# EAGLE schematic eib-128-256-nanoz-adapter (EAGLE 8.3.2)
DESIGNER: JPN@MIT; DESIGN_NAME: Headstage 128/256 NanoZ Adapter; LICENSE: CERN OHL v1.2; REVISION: 1.0
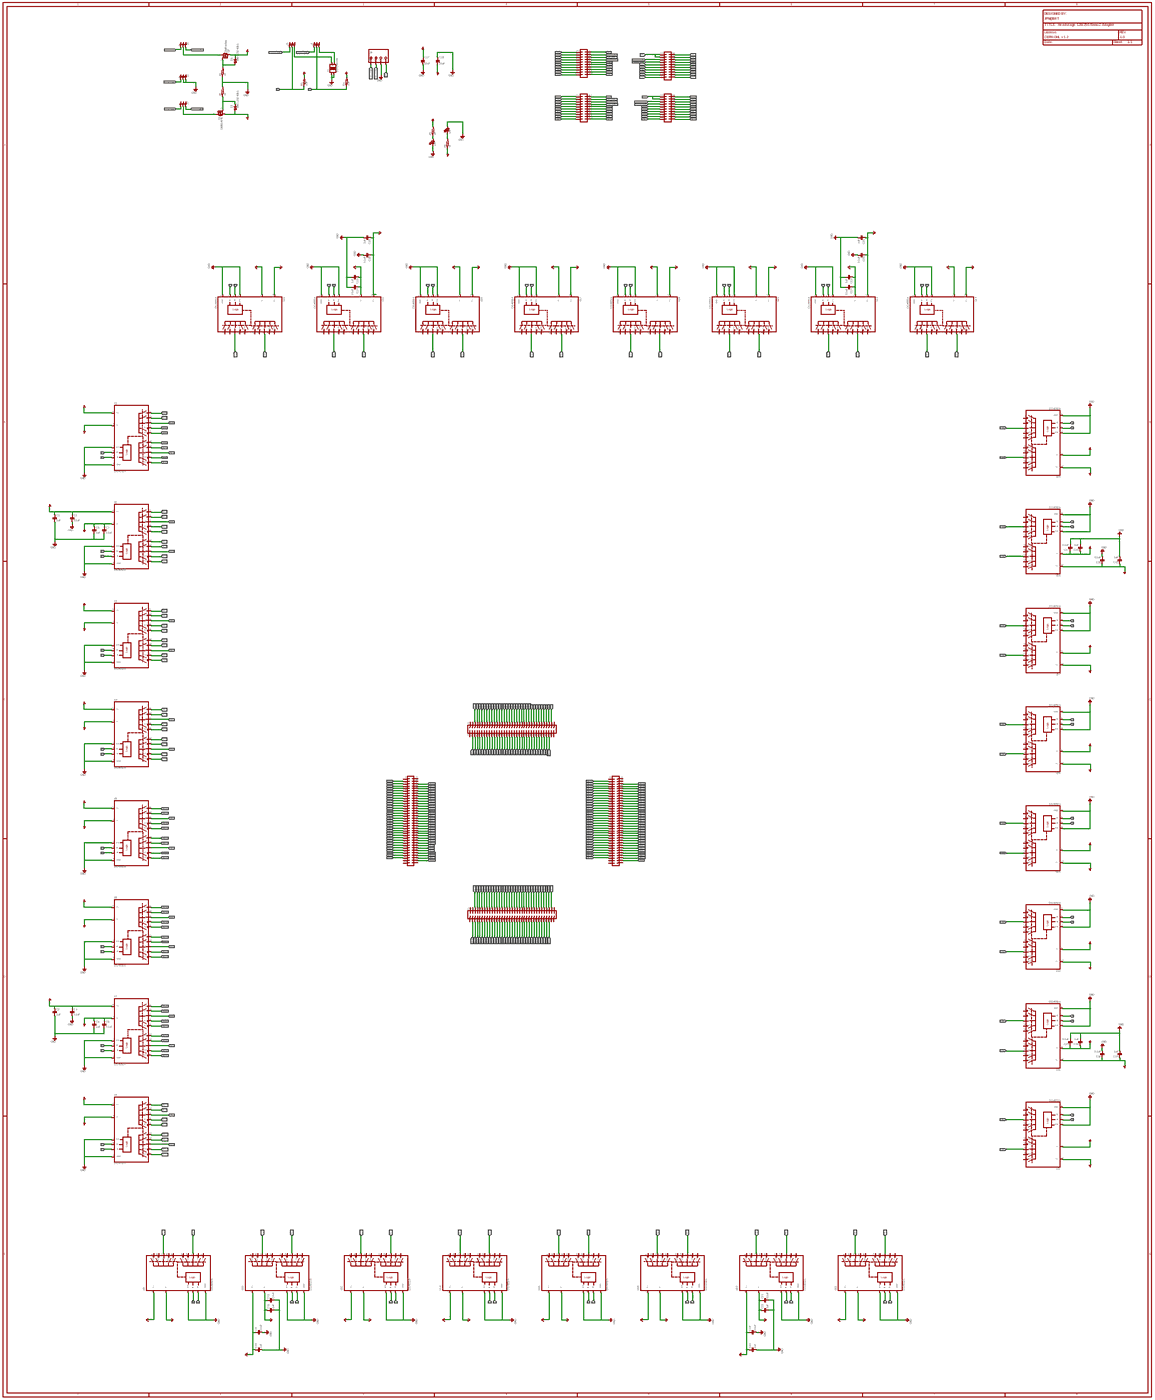
[diagram p0: schematic, sheet 1, overview]
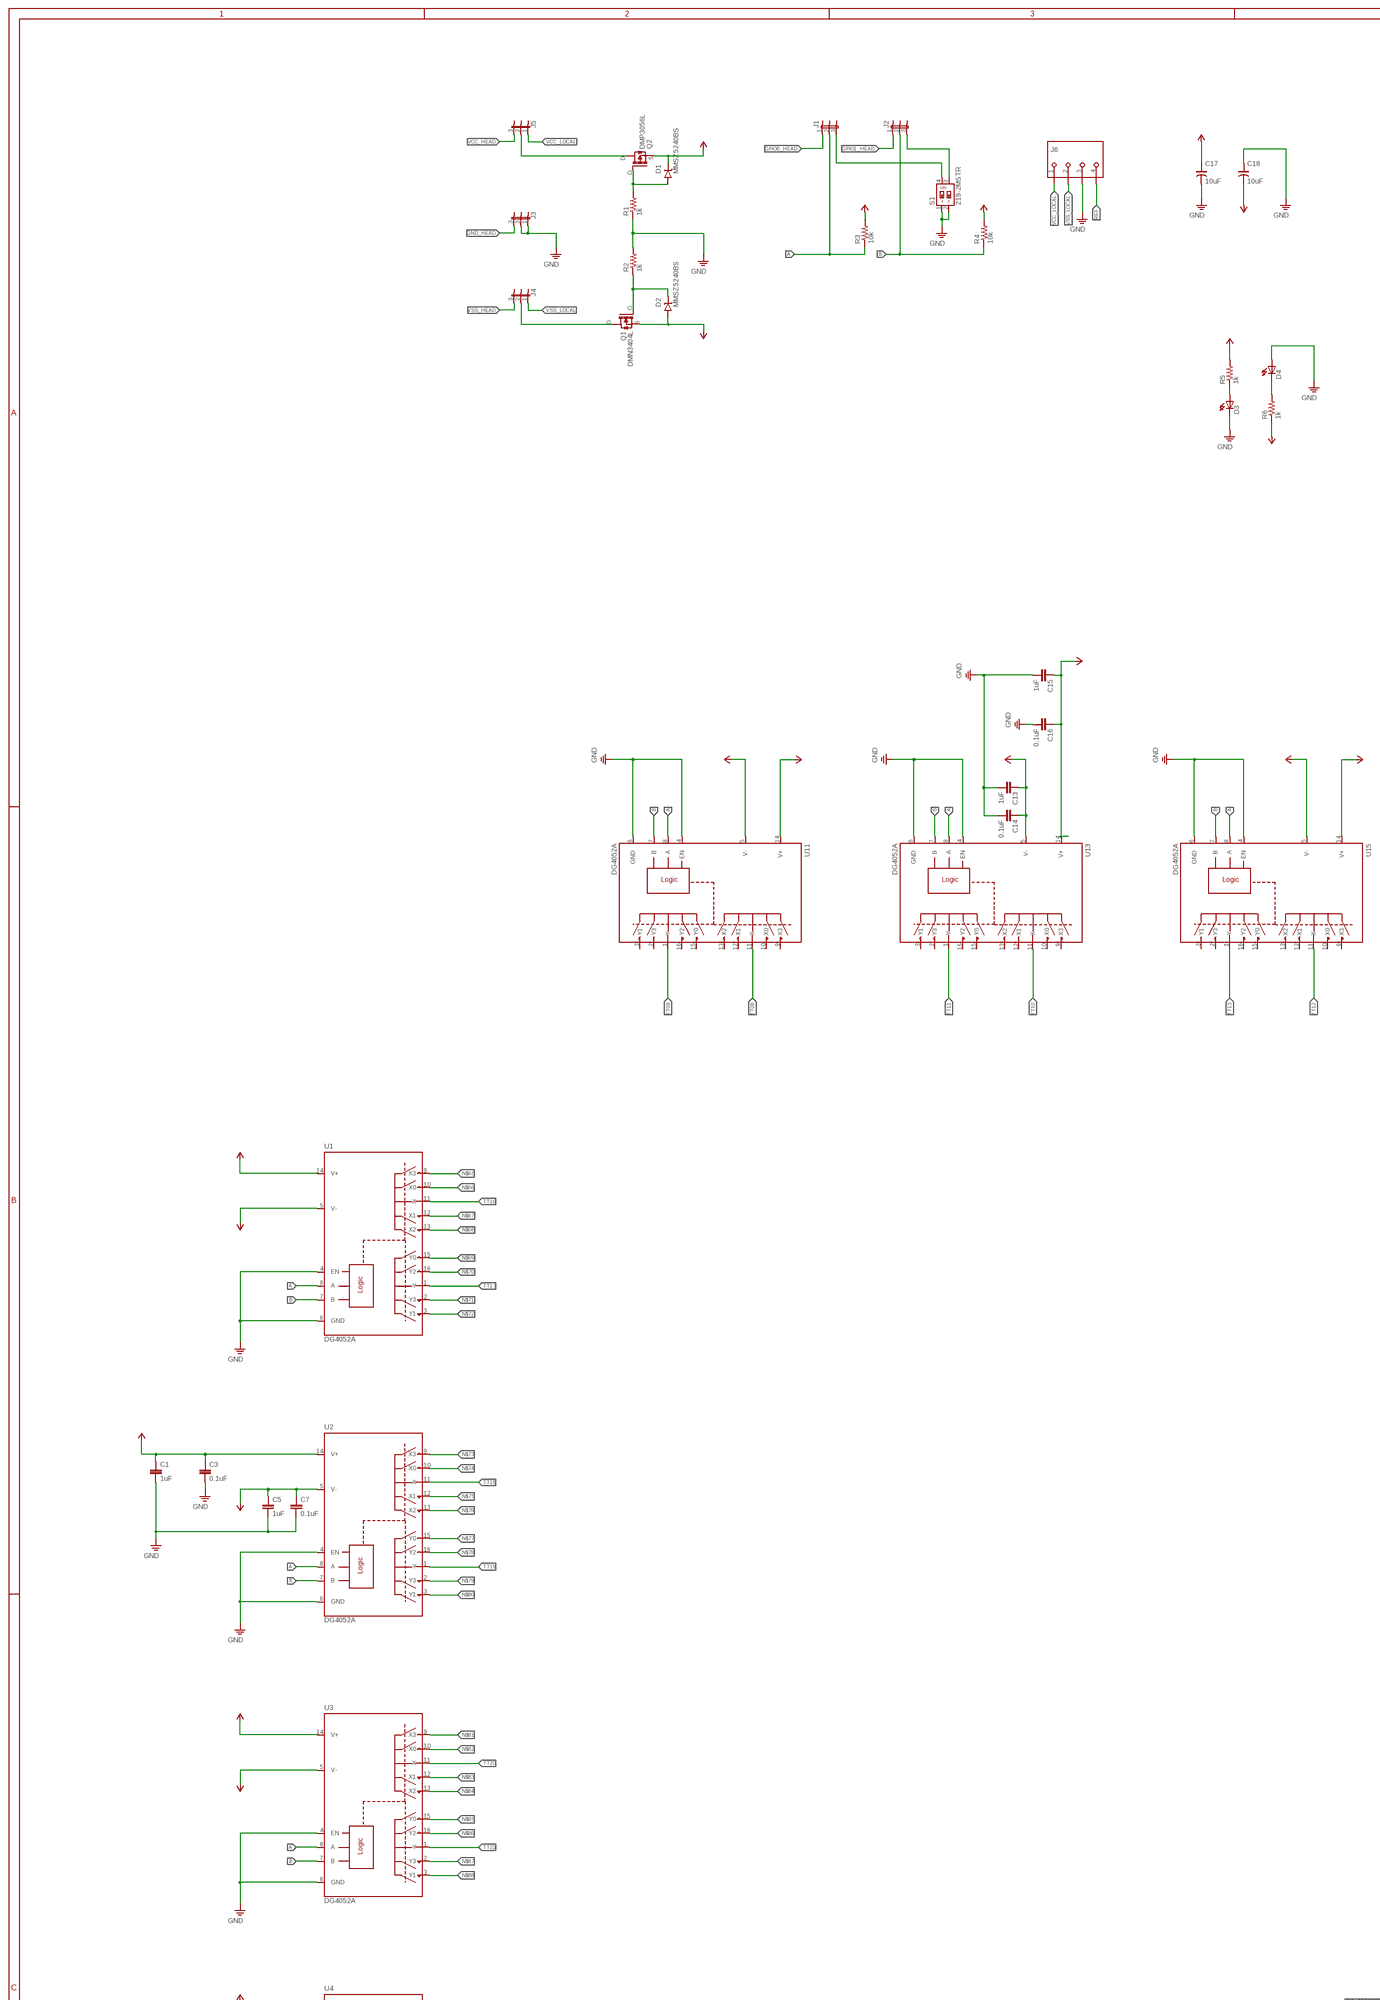
[diagram p1: schematic, sheet 1, part 1 of 4]
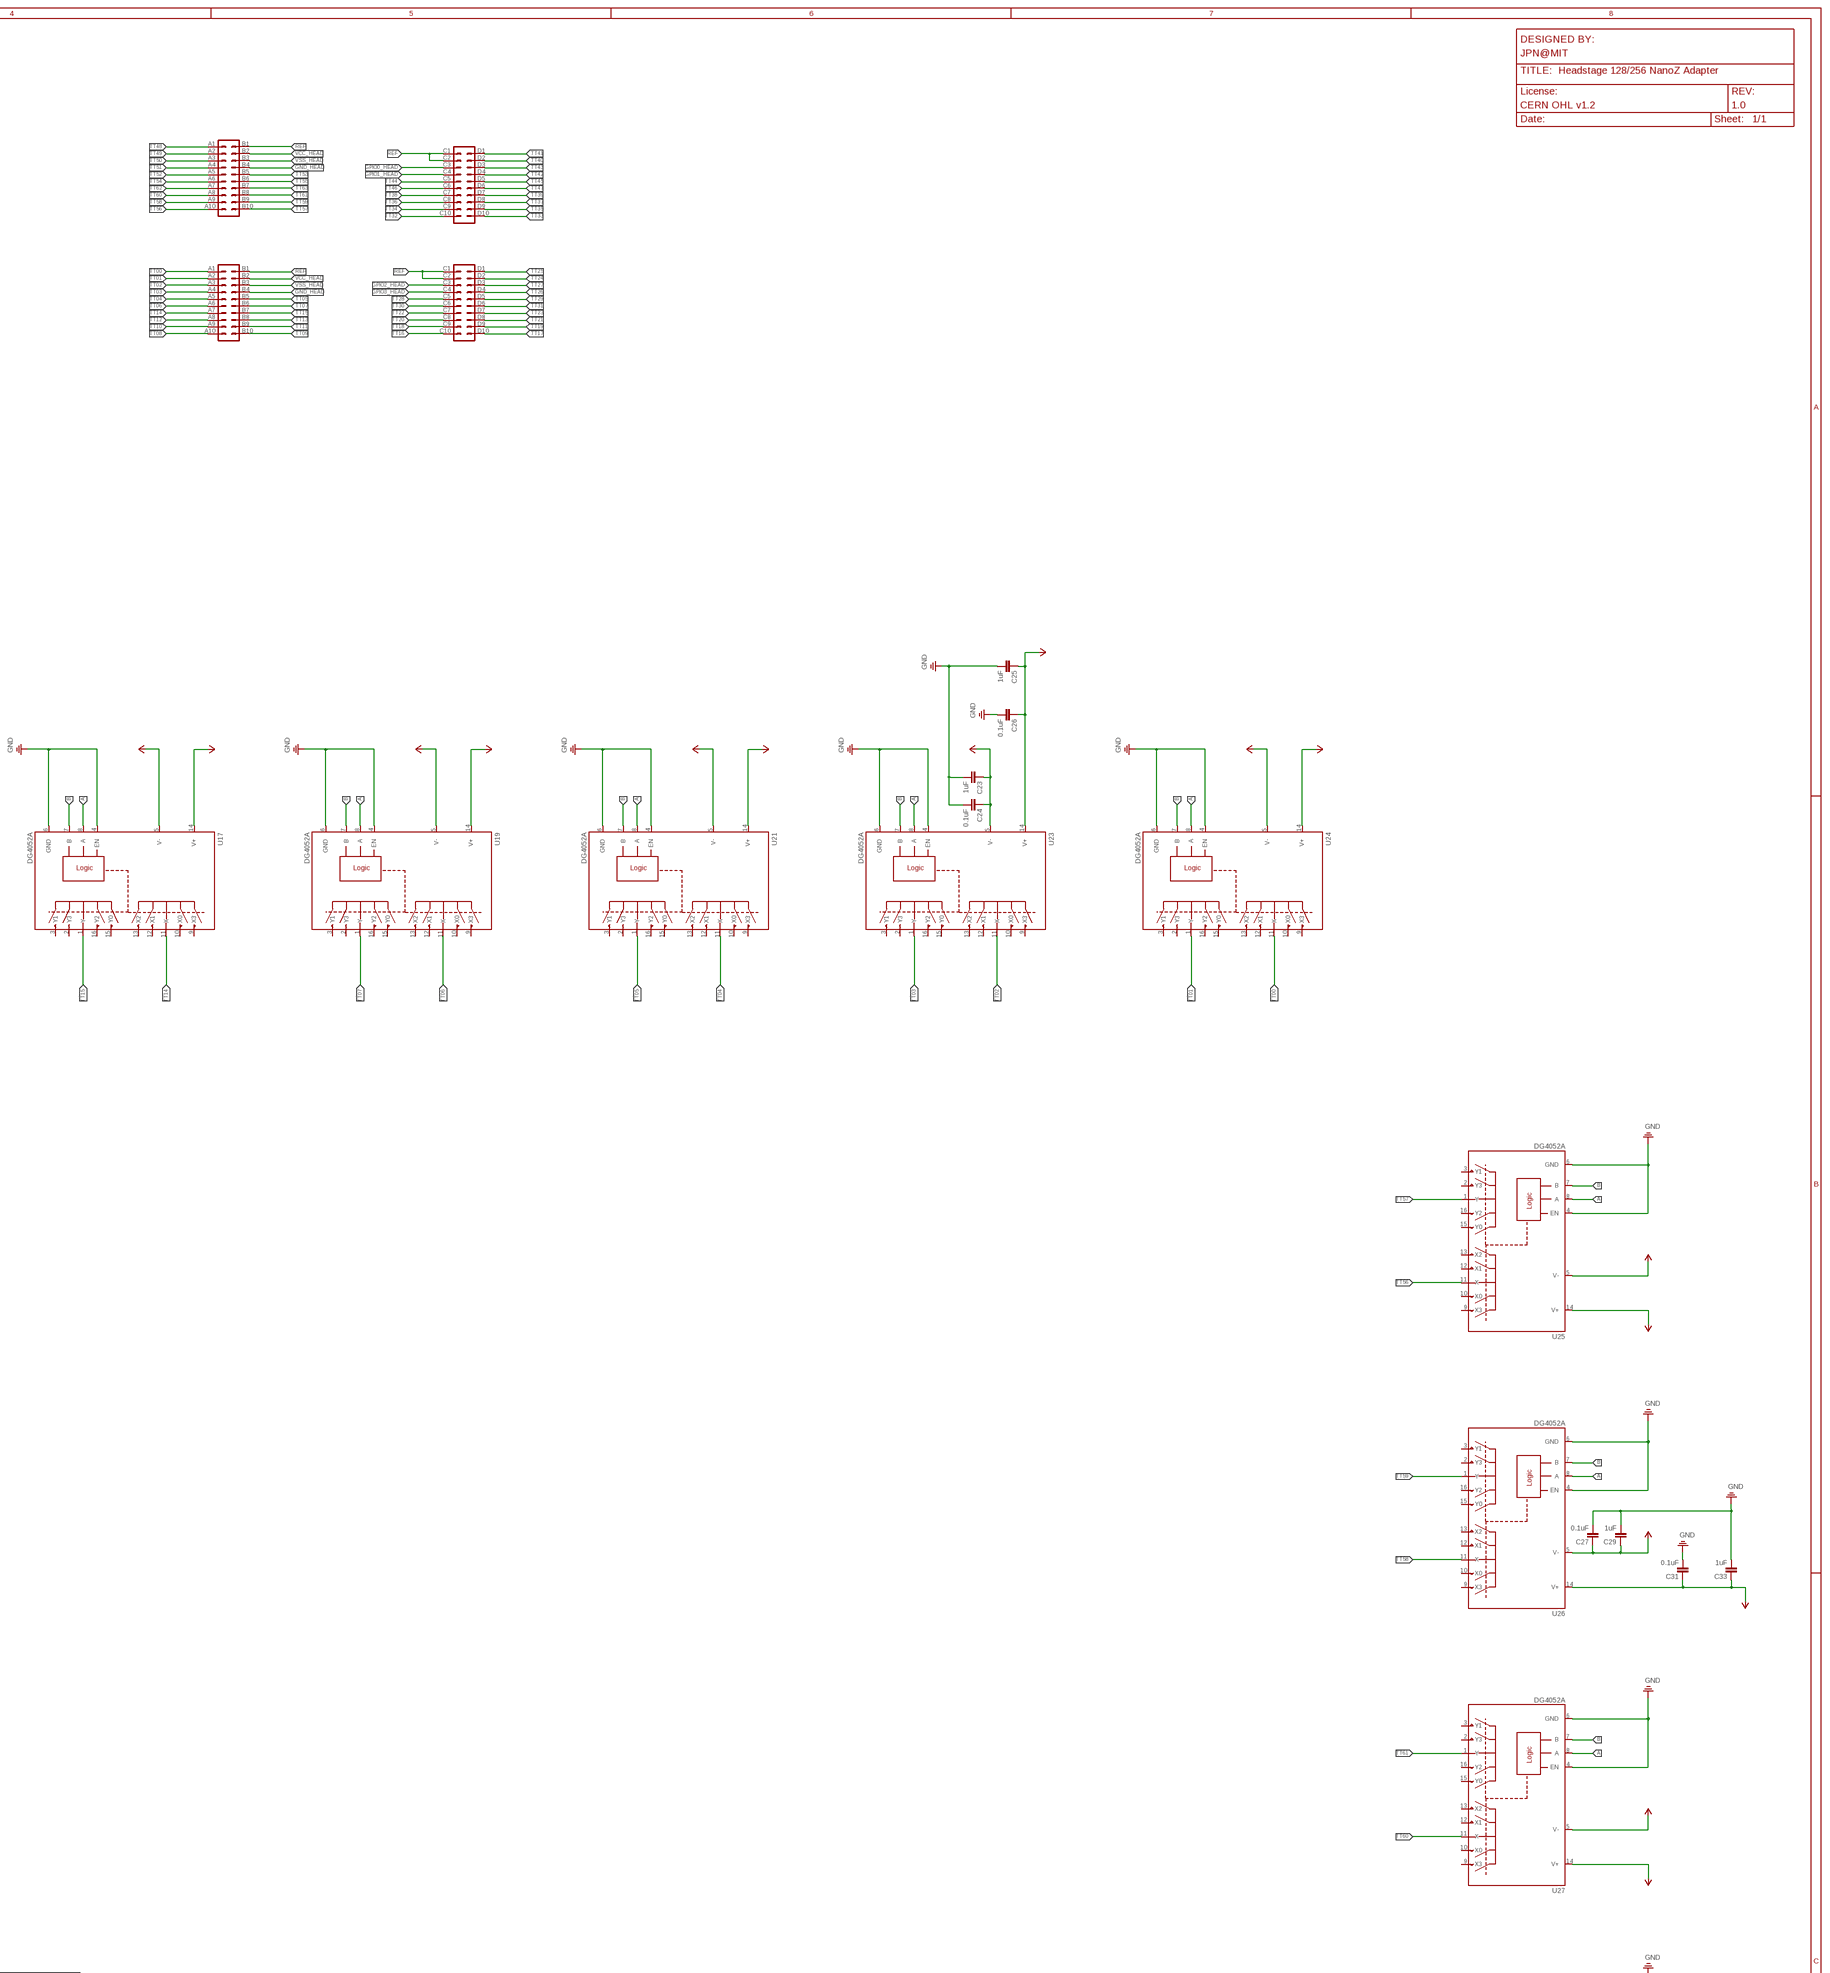
[diagram p2: schematic, sheet 1, part 2 of 4]
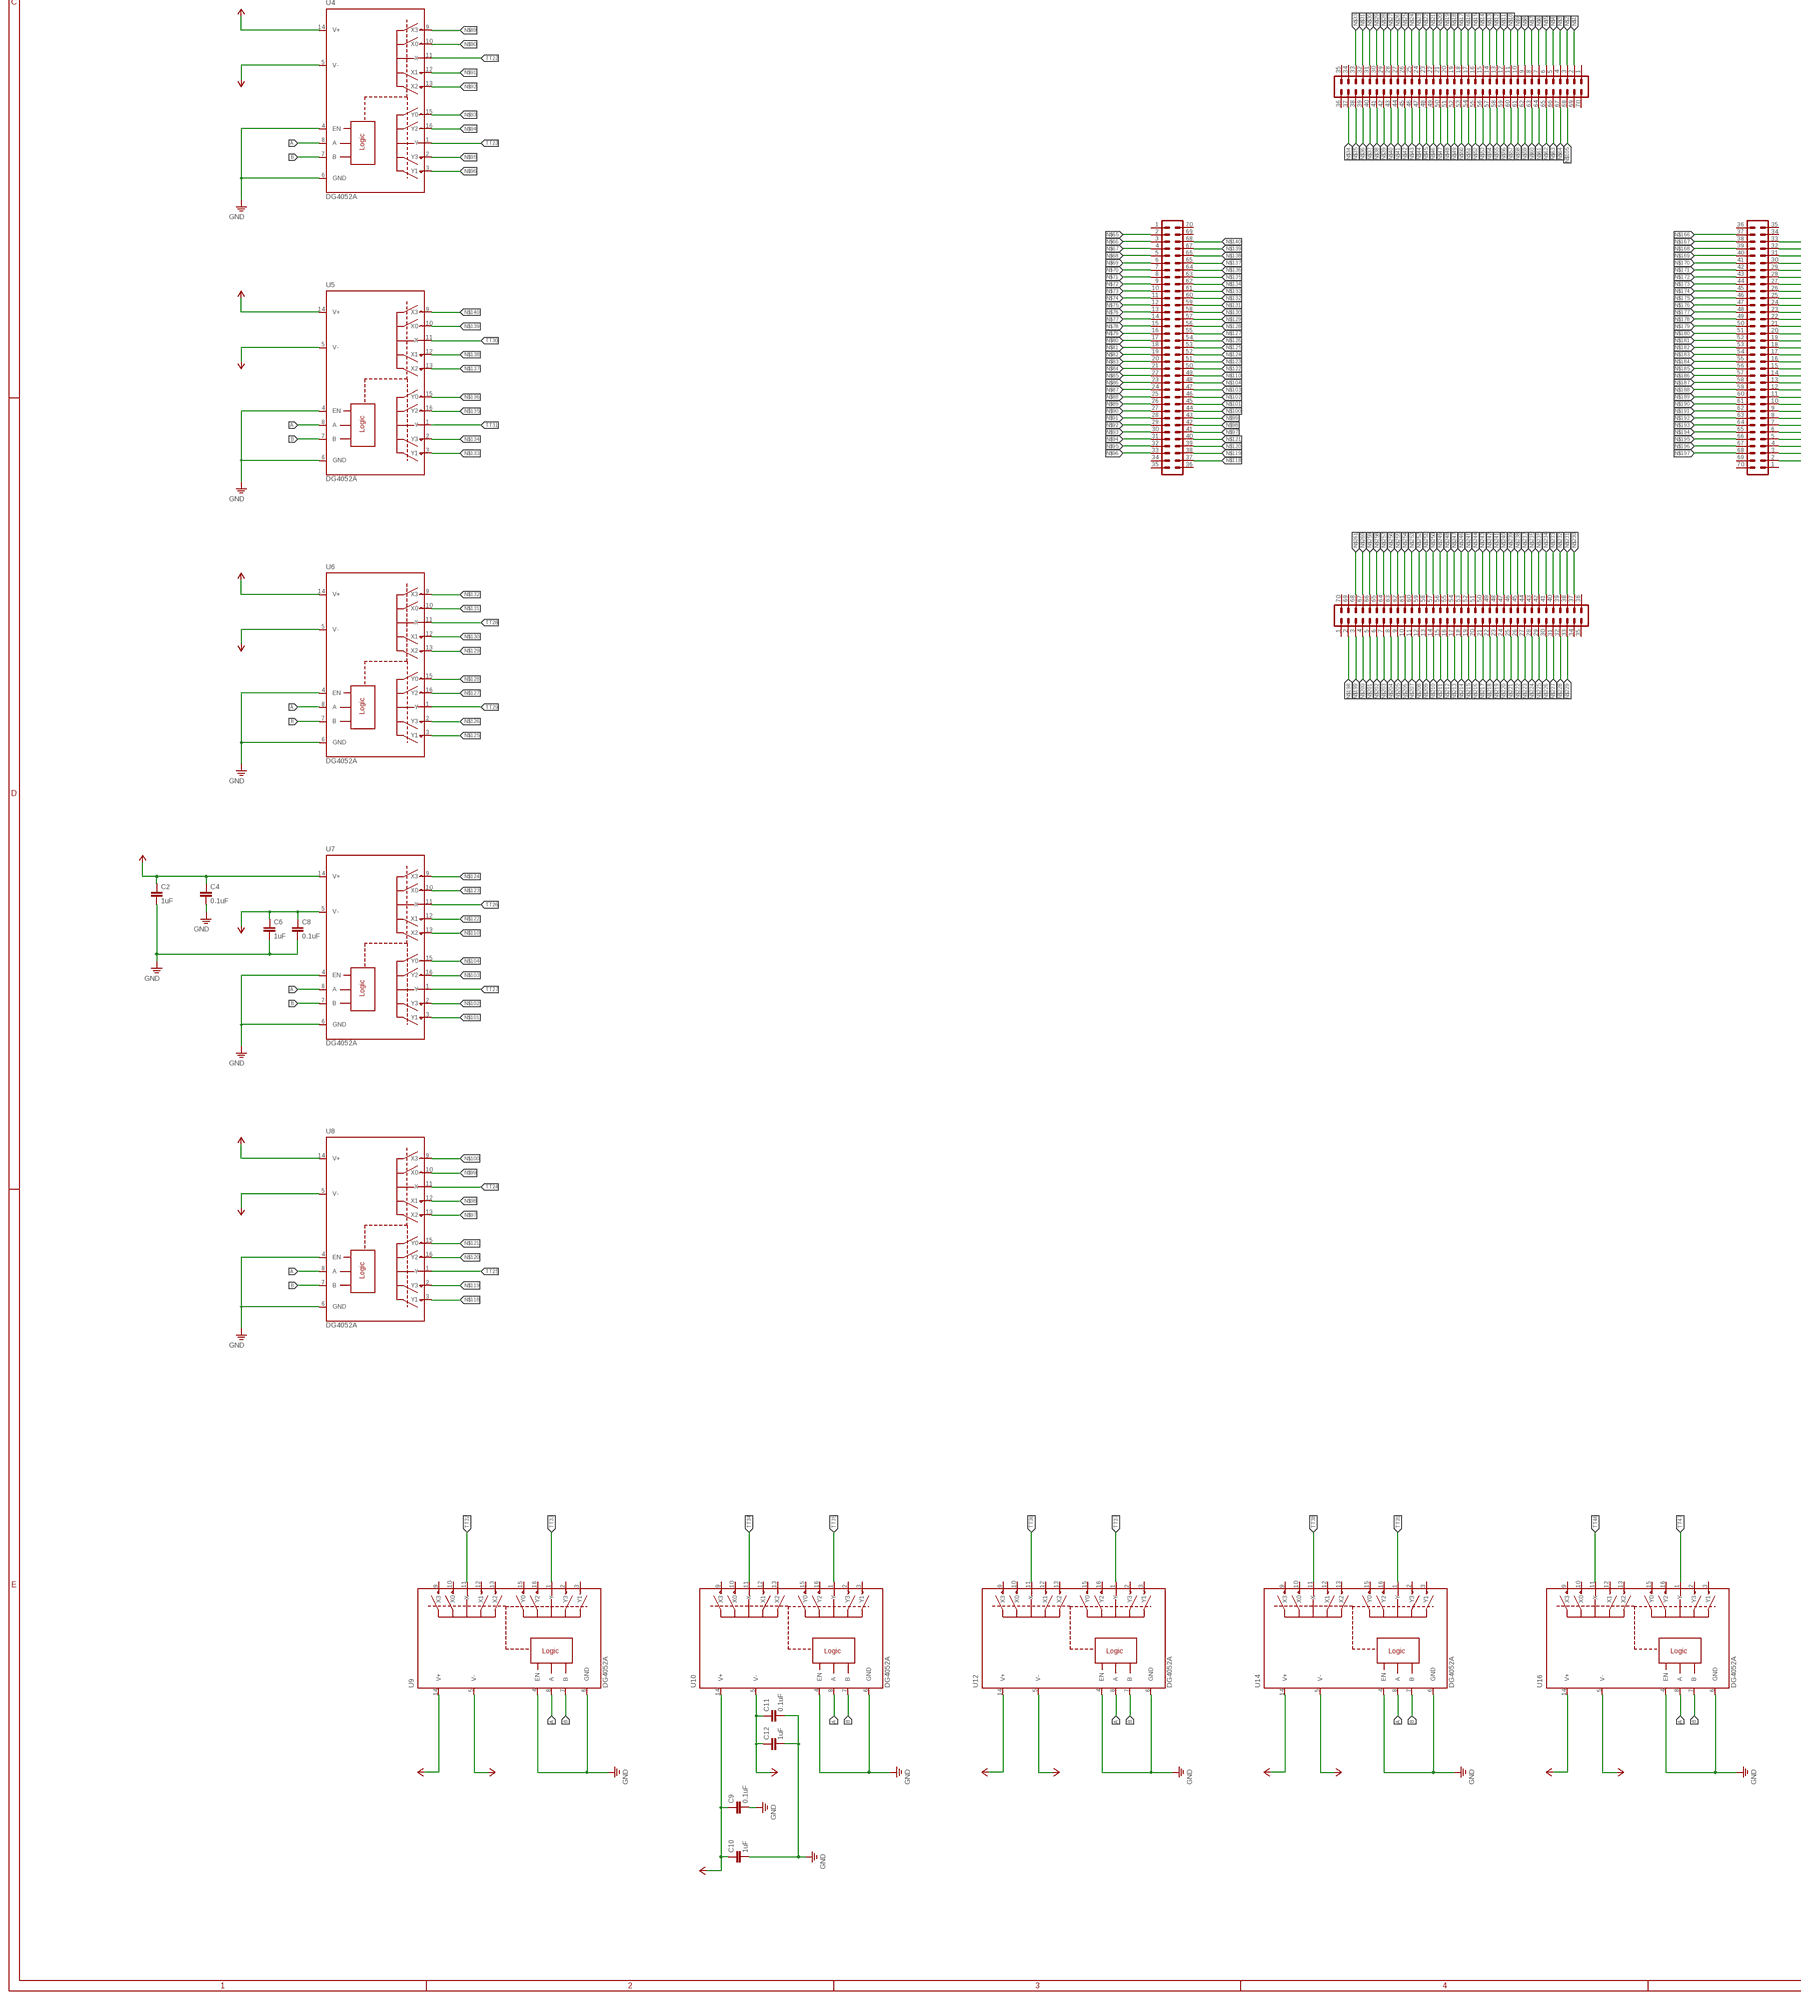
[diagram p3: schematic, sheet 1, part 3 of 4]
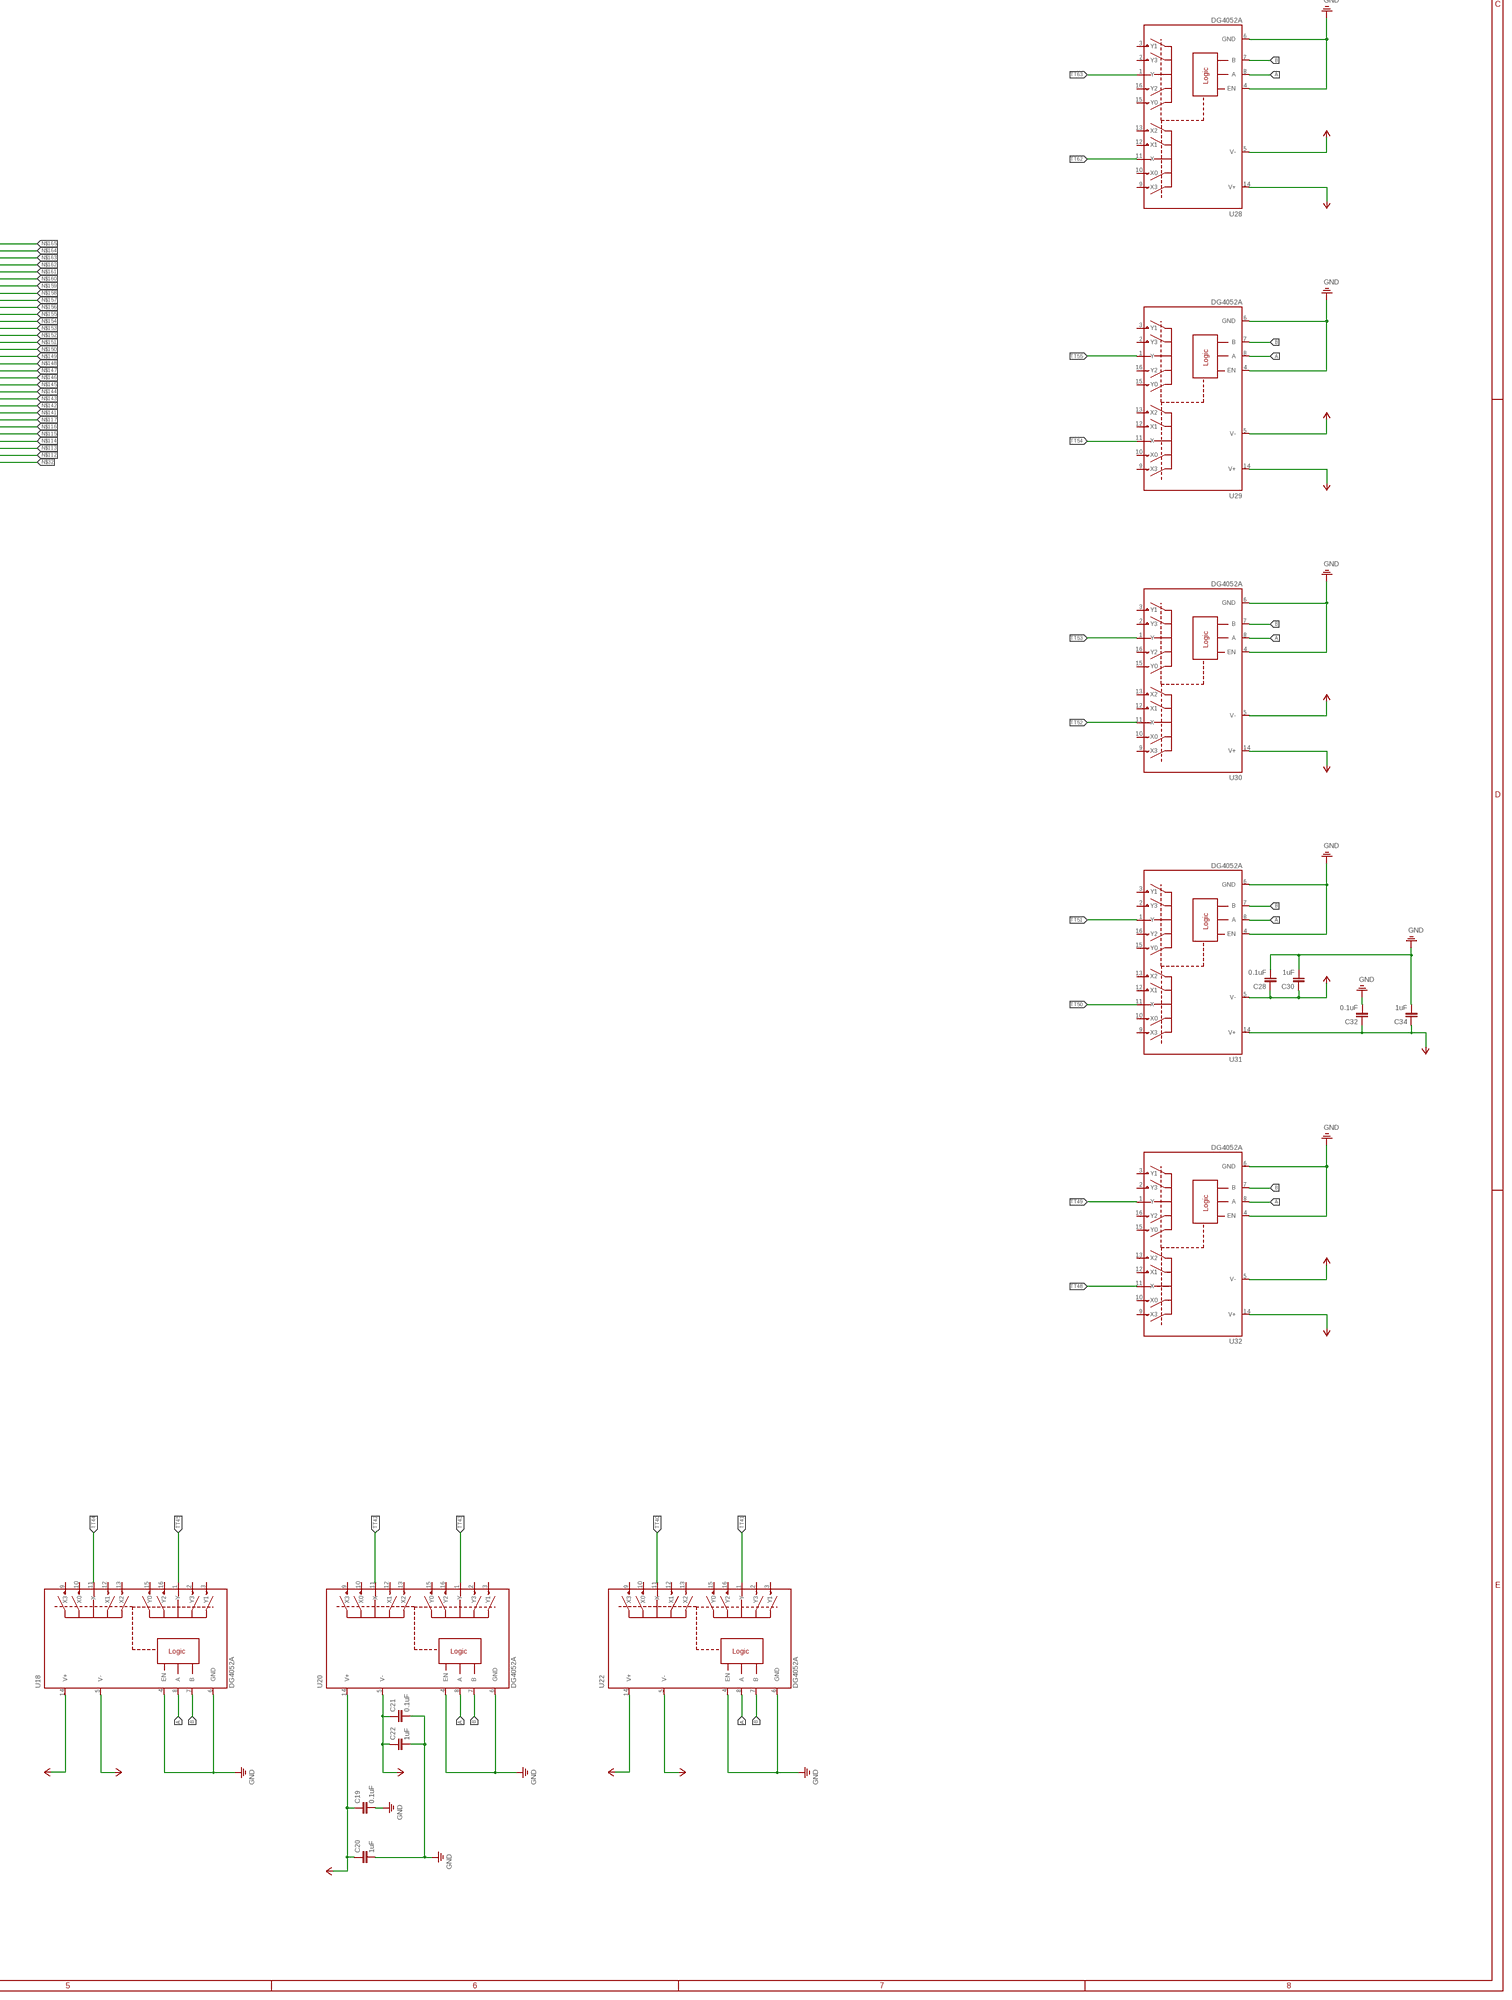
[diagram p4: schematic, sheet 1, part 4 of 4]

## Parts
A  DF40HEAD  PINHD-2X35_DF40REC  [DF40-70REC]
B  DF40HEAD  PINHD-2X35_DF40REC  [DF40-70REC]
C  DF40HEAD  PINHD-2X35_DF40REC  [DF40-70REC]
C1  1uF  C_0603  [0603]
C2  1uF  C_0603  [0603]
C3  0.1uF  C_0402  [0402]
C4  0.1uF  C_0402  [0402]
C5  1uF  C_0603  [0603]
C6  1uF  C_0603  [0603]
C7  0.1uF  C_0402  [0402]
C8  0.1uF  C_0402  [0402]
C9  0.1uF  C_0402  [0402]
C10  1uF  C_0603  [0603]
C11  0.1uF  C_0402  [0402]
C12  1uF  C_0603  [0603]
C13  1uF  C_0603  [0603]
C14  0.1uF  C_0402  [0402]
C15  1uF  C_0603  [0603]
C16  0.1uF  C_0402  [0402]
C17  10uF  C-POL_1210  [1210-POL]
C18  10uF  C-POL_1210  [1210-POL]
C19  0.1uF  C_0402  [0402]
C20  1uF  C_0603  [0603]
C21  0.1uF  C_0402  [0402]
C22  1uF  C_0603  [0603]
C23  1uF  C_0603  [0603]
C24  0.1uF  C_0402  [0402]
C25  1uF  C_0603  [0603]
C26  0.1uF  C_0402  [0402]
C27  0.1uF  C_0402  [0402]
C28  0.1uF  C_0402  [0402]
C29  1uF  C_0603  [0603]
C30  1uF  C_0603  [0603]
C31  0.1uF  C_0402  [0402]
C32  0.1uF  C_0402  [0402]
C33  1uF  C_0603  [0603]
C34  1uF  C_0603  [0603]
D  DF40HEAD  PINHD-2X35_DF40REC  [DF40-70REC]
D1  MMSZ5240BS  Z-DIODE_SOD-323  [SOD-323]
D2  MMSZ5240BS  Z-DIODE_SOD-323  [SOD-323]
D3  LED_0603  [LED-0603]
D4  LED_0603  [LED-0603]
J1  JP3E_SMD  [JP3_SMD]
J2  JP3E_SMD  [JP3_SMD]
J3  JP3E_SMD  [JP3_SMD]
J4  JP3E_SMD  [JP3_SMD]
J5  JP3E_SMD  [JP3_SMD]
J6  SCREW4  [SCREW4]
J7  PINHD-4X10_MOLC-THRU  [MOLC-110-11-S-Q]
J8  PINHD-4X10_MOLC-THRU  [MOLC-110-11-S-Q]
Q1  DMN3404L  N-MOSFET_SOT23-GSD  [SOT23-GSD]
Q2  DMP3056L  P-MOSFET_SOT23-GSD  [SOT23-GSD]
R1  1k  R_0603  [0603]
R2  1k  R_0603  [0603]
R3  10k  R_0603  [0603]
R4  10k  R_0603  [0603]
R5  1k  R_0603  [0603]
R6  1k  R_0603  [0603]
S1  219-2MSTR  DIPSW-002  [SMS-002]
U1  DG4052A  MUX_2X4:1_DG4052A-MQFN  [MQFN16-1.8X2.6]
U2  DG4052A  MUX_2X4:1_DG4052A-MQFN  [MQFN16-1.8X2.6]
U3  DG4052A  MUX_2X4:1_DG4052A-MQFN  [MQFN16-1.8X2.6]
U4  DG4052A  MUX_2X4:1_DG4052A-MQFN  [MQFN16-1.8X2.6]
U5  DG4052A  MUX_2X4:1_DG4052A-MQFN  [MQFN16-1.8X2.6]
U6  DG4052A  MUX_2X4:1_DG4052A-MQFN  [MQFN16-1.8X2.6]
U7  DG4052A  MUX_2X4:1_DG4052A-MQFN  [MQFN16-1.8X2.6]
U8  DG4052A  MUX_2X4:1_DG4052A-MQFN  [MQFN16-1.8X2.6]
U9  DG4052A  MUX_2X4:1_DG4052A-MQFN  [MQFN16-1.8X2.6]
U10  DG4052A  MUX_2X4:1_DG4052A-MQFN  [MQFN16-1.8X2.6]
U11  DG4052A  MUX_2X4:1_DG4052A-MQFN  [MQFN16-1.8X2.6]
U12  DG4052A  MUX_2X4:1_DG4052A-MQFN  [MQFN16-1.8X2.6]
U13  DG4052A  MUX_2X4:1_DG4052A-MQFN  [MQFN16-1.8X2.6]
U14  DG4052A  MUX_2X4:1_DG4052A-MQFN  [MQFN16-1.8X2.6]
U15  DG4052A  MUX_2X4:1_DG4052A-MQFN  [MQFN16-1.8X2.6]
U16  DG4052A  MUX_2X4:1_DG4052A-MQFN  [MQFN16-1.8X2.6]
U17  DG4052A  MUX_2X4:1_DG4052A-MQFN  [MQFN16-1.8X2.6]
U18  DG4052A  MUX_2X4:1_DG4052A-MQFN  [MQFN16-1.8X2.6]
U19  DG4052A  MUX_2X4:1_DG4052A-MQFN  [MQFN16-1.8X2.6]
U20  DG4052A  MUX_2X4:1_DG4052A-MQFN  [MQFN16-1.8X2.6]
U21  DG4052A  MUX_2X4:1_DG4052A-MQFN  [MQFN16-1.8X2.6]
U22  DG4052A  MUX_2X4:1_DG4052A-MQFN  [MQFN16-1.8X2.6]
U23  DG4052A  MUX_2X4:1_DG4052A-MQFN  [MQFN16-1.8X2.6]
U24  DG4052A  MUX_2X4:1_DG4052A-MQFN  [MQFN16-1.8X2.6]
U25  DG4052A  MUX_2X4:1_DG4052A-MQFN  [MQFN16-1.8X2.6]
U26  DG4052A  MUX_2X4:1_DG4052A-MQFN  [MQFN16-1.8X2.6]
U27  DG4052A  MUX_2X4:1_DG4052A-MQFN  [MQFN16-1.8X2.6]
U28  DG4052A  MUX_2X4:1_DG4052A-MQFN  [MQFN16-1.8X2.6]
U29  DG4052A  MUX_2X4:1_DG4052A-MQFN  [MQFN16-1.8X2.6]
U30  DG4052A  MUX_2X4:1_DG4052A-MQFN  [MQFN16-1.8X2.6]
U31  DG4052A  MUX_2X4:1_DG4052A-MQFN  [MQFN16-1.8X2.6]
U32  DG4052A  MUX_2X4:1_DG4052A-MQFN  [MQFN16-1.8X2.6]

## Nets
A: J1.2 R3.1 U1.8(A) U2.8(A) U3.8(A) U4.8(A) U5.8(A) U6.8(A) U7.8(A) U8.8(A) U9.8(A) U10.8(A) U11.8(A) U12.8(A) U13.8(A) U14.8(A) U15.8(A) U16.8(A) U17.8(A) U18.8(A) U19.8(A) U20.8(A) U21.8(A) U22.8(A) U23.8(A) U24.8(A) U25.8(A) U26.8(A) U27.8(A) U28.8(A) U29.8(A) U30.8(A) U31.8(A) U32.8(A)
B: J2.2 R4.1 U1.7(B) U2.7(B) U3.7(B) U4.7(B) U5.7(B) U6.7(B) U7.7(B) U8.7(B) U9.7(B) U10.7(B) U11.7(B) U12.7(B) U13.7(B) U14.7(B) U15.7(B) U16.7(B) U17.7(B) U18.7(B) U19.7(B) U20.7(B) U21.7(B) U22.7(B) U23.7(B) U24.7(B) U25.7(B) U26.7(B) U27.7(B) U28.7(B) U29.7(B) U30.7(B) U31.7(B) U32.7(B)
GND: C1.2 C2.2 C3.2 C4.2 C5.2 C6.2 C7.2 C8.2 C9.2 C10.2 C11.2 C12.2 C13.2 C14.2 C15.2 C16.2 C17.- C18.+ C19.2 C20.2 C21.2 C22.2 C23.2 C24.2 C25.2 C26.2 C27.2 C28.2 C29.2 C30.2 C31.2 C32.2 C33.2 C34.2 D3.C D4.A J3.1 J3.2 J6.3 R1.1 R2.2 S1.1 S1.2 U1.4(EN) U1.6(GND) U2.4(EN) U2.6(GND) U3.4(EN) U3.6(GND) U4.4(EN) U4.6(GND) U5.4(EN) U5.6(GND) U6.4(EN) U6.6(GND) U7.4(EN) U7.6(GND) U8.4(EN) U8.6(GND) U9.4(EN) U9.6(GND) U10.4(EN) U10.6(GND) U11.4(EN) U11.6(GND) U12.4(EN) U12.6(GND) U14.4(EN) U14.6(GND) U15.4(EN) U15.6(GND) U16.4(EN) U16.6(GND) U17.4(EN) U17.6(GND) U18.4(EN) U18.6(GND) U19.4(EN) U19.6(GND) U20.4(EN) U20.6(GND) U21.4(EN) U21.6(GND) U22.4(EN) U22.6(GND) U24.4(EN) U24.6(GND) U25.4(EN) U25.6(GND) U26.4(EN) U26.6(GND) U27.4(EN) U27.6(GND) U28.4(EN) U28.6(GND) U29.4(EN) U29.6(GND) U30.4(EN) U30.6(GND) U32.4(EN) U32.6(GND)
GND1: U13.6(GND)
GND2: U23.6(GND)
GND4: U31.6(GND)
GND_HEAD: J3.3 J7.B4
GPIO0_HEAD: J1.1 J7.C3
GPIO1_HEAD: J2.1 J7.C4
GPIO2_HEAD: J8.C3
GPIO3_HEAD: J8.C4
N$1: A.2
N$2: A.3
N$3: A.4
N$4: A.5
N$5: A.6
N$6: A.7
N$7: A.8
N$8: A.9
N$9: A.10
N$10: A.11
N$11: A.12
N$12: A.13
N$13: A.14
N$14: A.15
N$15: A.16
N$16: A.17
N$17: A.18
N$18: A.19
N$19: A.20
N$20: A.21
N$21: A.22
N$22: A.23
N$23: A.24
N$24: A.25
N$25: A.26
N$26: A.27
N$27: A.28
N$28: A.29
N$29: A.30
N$30: A.31
N$31: A.32
N$32: D.2
N$33: A.33
N$34: A.37
N$35: A.38
N$36: A.39
N$37: A.40
N$38: A.41
N$39: A.42
N$40: A.43
N$41: A.44
N$42: A.45
N$43: A.46
N$44: A.47
N$45: A.48
N$46: A.49
N$47: A.50
N$48: A.51
N$49: A.52
N$50: A.53
N$51: A.54
N$52: A.55
N$53: A.56
N$54: A.57
N$55: A.58
N$56: A.59
N$57: A.60
N$58: A.61
N$59: A.62
N$60: A.63
N$61: A.64
N$62: A.65
N$63: A.66
N$64: A.67
N$65: C.2 U1.9(X3)
N$66: C.3 U1.10(X0)
N$67: C.4 U1.12(X1)
N$68: C.5 U1.13(X2)
N$69: C.6 U1.15(Y0)
N$70: C.7 U1.16(Y2)
N$71: C.8 U1.2(Y3)
N$72: C.9 U1.3(Y1)
N$73: C.10 U2.9(X3)
N$74: C.11 U2.10(X0)
N$75: C.12 U2.12(X1)
N$76: C.13 U2.13(X2)
N$77: C.14 U2.15(Y0)
N$78: C.15 U2.16(Y2)
N$79: C.16 U2.2(Y3)
N$80: C.17 U2.3(Y1)
N$81: C.18 U3.9(X3)
N$82: C.19 U3.10(X0)
N$83: C.20 U3.12(X1)
N$84: C.21 U3.13(X2)
N$85: C.22 U3.15(Y0)
N$86: C.23 U3.16(Y2)
N$87: C.24 U3.2(Y3)
N$88: C.25 U3.3(Y1)
N$89: C.26 U4.9(X3)
N$90: C.27 U4.10(X0)
N$91: C.28 U4.12(X1)
N$92: C.29 U4.13(X2)
N$93: C.30 U4.15(Y0)
N$94: C.31 U4.16(Y2)
N$95: C.32 U4.2(Y3)
N$96: C.33 U4.3(Y1)
N$97: C.41 U8.13(X2)
N$98: C.42 U8.12(X1)
N$99: C.43 U8.10(X0)
N$100: C.44 U8.9(X3)
N$101: C.45 U7.3(Y1)
N$102: C.46 U7.2(Y3)
N$103: C.47 U7.16(Y2)
N$104: C.48 U7.15(Y0)
N$105: A.68
N$110: C.49 U7.13(X2)
N$112: D.3
N$113: D.4
N$114: D.5
N$115: D.6
N$116: D.7
N$117: D.8
N$118: C.37 U8.3(Y1)
N$119: C.38 U8.2(Y3)
N$120: C.39 U8.16(Y2)
N$121: C.40 U8.15(Y0)
N$122: C.50 U7.12(X1)
N$123: C.51 U7.10(X0)
N$124: C.52 U7.9(X3)
N$125: C.53 U6.3(Y1)
N$126: C.54 U6.2(Y3)
N$127: C.55 U6.16(Y2)
N$128: C.56 U6.15(Y0)
N$129: C.57 U6.13(X2)
N$130: C.58 U6.12(X1)
N$131: C.59 U6.10(X0)
N$132: C.60 U6.9(X3)
N$133: C.61 U5.3(Y1)
N$134: C.62 U5.2(Y3)
N$135: C.63 U5.16(Y2)
N$136: C.64 U5.15(Y0)
N$137: C.65 U5.13(X2)
N$138: C.66 U5.12(X1)
N$139: C.67 U5.10(X0)
N$140: C.68 U5.9(X3)
N$141: D.9
N$142: D.10
N$143: D.11
N$144: D.12
N$145: D.13
N$146: D.14
N$147: D.15
N$148: D.16
N$149: D.17
N$150: D.18
N$151: D.19
N$152: D.20
N$153: D.21
N$154: D.22
N$155: D.23
N$156: D.24
N$157: D.25
N$158: D.26
N$159: D.27
N$160: D.28
N$161: D.29
N$162: D.30
N$163: D.31
N$164: D.32
N$165: D.33
N$166: D.37
N$167: D.38
N$168: D.39
N$169: D.40
N$170: D.41
N$171: D.42
N$172: D.43
N$173: D.44
N$174: D.45
N$175: D.46
N$176: D.47
N$177: D.48
N$178: D.49
N$179: D.50
N$180: D.51
N$181: D.52
N$182: D.53
N$183: D.54
N$184: D.55
N$185: D.56
N$186: D.57
N$187: D.58
N$188: D.59
N$189: D.60
N$190: D.61
N$191: D.62
N$192: D.63
N$193: D.64
N$194: D.65
N$195: D.66
N$196: D.67
N$197: D.68
N$198: B.2
N$199: B.3
N$200: B.4
N$201: B.5
N$202: B.6
N$203: B.7
N$204: B.8
N$205: B.9
N$206: B.10
N$207: B.11
N$208: B.12
N$209: B.13
N$210: B.14
N$211: B.15
N$212: B.16
N$213: B.17
N$214: B.18
N$215: B.19
N$216: B.20
N$217: B.21
N$218: B.22
N$219: B.23
N$220: B.24
N$221: B.25
N$222: B.26
N$223: B.27
N$224: B.28
N$225: B.29
N$226: B.30
N$227: B.31
N$228: B.32
N$229: B.33
N$230: B.37
N$231: B.38
N$232: B.39
N$233: B.40
N$234: B.41
N$235: B.42
N$236: B.43
N$237: B.44
N$238: B.45
N$239: B.46
N$240: B.47
N$241: B.48
N$242: B.49
N$243: B.50
N$244: B.51
N$245: B.52
N$246: B.53
N$247: B.54
N$248: B.55
N$249: B.56
N$250: B.57
N$251: B.58
N$252: B.59
N$253: B.60
N$254: B.61
N$255: B.62
N$256: B.63
N$257: B.64
N$258: B.65
N$259: B.66
N$260: B.67
N$261: B.68
N$449: D3.A R5.1
N$450: D1.A Q2.G R1.2
N$451: D4.C R6.2
N$452: U13.4(EN)
N$453: U23.4(EN)
N$454: D2.C Q1.G R2.1
N$456: U31.4(EN)
N$457: J1.3 S1.4
N$460: J2.3 S1.3
REF: J6.4 J7.B1 J7.C1 J7.C2 J8.B1 J8.C1 J8.C2
TT00: J8.A1 U24.11(X)
TT01: J8.A2 U24.1(Y)
TT02: J8.A3 U23.11(X)
TT03: J8.A4 U23.1(Y)
TT04: J8.A5 U21.11(X)
TT05: J8.B5 U21.1(Y)
TT06: J8.A6 U19.11(X)
TT07: J8.B6 U19.1(Y)
TT08: J8.A10 U11.11(X)
TT09: J8.B10 U11.1(Y)
TT10: J8.A9 U13.11(X)
TT11: J8.B9 U13.1(Y)
TT12: J8.A8 U15.11(X)
TT13: J8.B8 U15.1(Y)
TT14: J8.A7 U17.11(X)
TT15: J8.B7 U17.1(Y)
TT16: J8.C10 U1.11(X)
TT17: J8.D10 U1.1(Y)
TT18: J8.C9 U2.11(X)
TT19: J8.D9 U2.1(Y)
TT20: J8.C8 U3.11(X)
TT21: J8.D8 U3.1(Y)
TT22: J8.C7 U4.11(X)
TT23: J8.D7 U4.1(Y)
TT24: J8.D2 U8.11(X)
TT25: J8.D1 U8.1(Y)
TT26: J8.D4 U7.11(X)
TT27: J8.D3 U7.1(Y)
TT28: J8.C5 U6.11(X)
TT29: J8.D5 U6.1(Y)
TT30: J8.C6 U5.11(X)
TT31: J8.D6 U5.1(Y)
TT32: J7.C10 U9.11(X)
TT33: J7.D10 U9.1(Y)
TT34: J7.C9 U10.11(X)
TT35: J7.D9 U10.1(Y)
TT36: J7.C8 U12.11(X)
TT37: J7.D8 U12.1(Y)
TT38: J7.C7 U14.11(X)
TT39: J7.D7 U14.1(Y)
TT40: J7.D2 U22.11(X)
TT41: J7.D1 U22.1(Y)
TT42: J7.D4 U20.11(X)
TT43: J7.D3 U20.1(Y)
TT44: J7.C5 U18.11(X)
TT45: J7.D5 U18.1(Y)
TT46: J7.C6 U16.11(X)
TT47: J7.D6 U16.1(Y)
TT48: J7.A1 U32.11(X)
TT49: J7.A2 U32.1(Y)
TT50: J7.A3 U31.11(X)
TT51: J7.A4 U31.1(Y)
TT52: J7.A5 U30.11(X)
TT53: J7.B5 U30.1(Y)
TT54: J7.A6 U29.11(X)
TT55: J7.B6 U29.1(Y)
TT56: J7.A10 U25.11(X)
TT57: J7.B10 U25.1(Y)
TT58: J7.A9 U26.11(X)
TT59: J7.B9 U26.1(Y)
TT60: J7.A8 U27.11(X)
TT61: J7.B8 U27.1(Y)
TT62: J7.A7 U28.11(X)
TT63: J7.B7 U28.1(Y)
VCC: C1.1 C2.1 C3.1 C4.1 C9.1 C10.1 C15.1 C16.1 C17.+ C19.1 C20.1 C25.1 C26.1 C31.1 C32.1 C33.1 C34.1 D1.C Q2.S R3.2 R4.2 R5.2 U1.14(V+) U2.14(V+) U3.14(V+) U4.14(V+) U5.14(V+) U6.14(V+) U7.14(V+) U8.14(V+) U9.14(V+) U10.14(V+) U11.14(V+) U12.14(V+) U13.14(V+) U14.14(V+) U15.14(V+) U16.14(V+) U17.14(V+) U18.14(V+) U19.14(V+) U20.14(V+) U21.14(V+) U22.14(V+) U23.14(V+) U24.14(V+) U25.14(V+) U26.14(V+) U27.14(V+) U28.14(V+) U29.14(V+) U30.14(V+) U31.14(V+) U32.14(V+)
VCC_HEAD: J5.3 J7.B2
VCC_LOCAL: J5.1 J6.1
VCC_PRE: J5.2 Q2.D
VSS: C5.1 C6.1 C7.1 C8.1 C11.1 C12.1 C13.1 C14.1 C18.- C21.1 C22.1 C23.1 C24.1 C27.1 C28.1 C29.1 C30.1 D2.A Q1.S R6.1 U1.5(V-) U2.5(V-) U3.5(V-) U4.5(V-) U5.5(V-) U6.5(V-) U7.5(V-) U8.5(V-) U9.5(V-) U10.5(V-) U11.5(V-) U12.5(V-) U13.5(V-) U14.5(V-) U15.5(V-) U16.5(V-) U17.5(V-) U18.5(V-) U19.5(V-) U20.5(V-) U21.5(V-) U22.5(V-) U23.5(V-) U24.5(V-) U25.5(V-) U26.5(V-) U27.5(V-) U28.5(V-) U29.5(V-) U30.5(V-) U31.5(V-) U32.5(V-)
VSS_HEAD: J4.3 J7.B3
VSS_LOCAL: J4.1 J6.2
VSS_PRE: J4.2 Q1.D
Unconnected: A.1 A.34 A.35 A.36 A.69 A.70 B.1 B.34 B.35 B.36 B.69 B.70 C.1 C.34 C.35 C.36 C.69 C.70 D.1 D.34 D.35 D.36 D.69 D.70 J8.B2 J8.B3 J8.B4 U9.2(Y3) U9.3(Y1) U9.9(X3) U9.10(X0) U9.12(X1) U9.13(X2) U9.15(Y0) U9.16(Y2) U10.2(Y3) U10.3(Y1) U10.9(X3) U10.10(X0) U10.12(X1) U10.13(X2) U10.15(Y0) U10.16(Y2) U11.2(Y3) U11.3(Y1) U11.9(X3) U11.10(X0) U11.12(X1) U11.13(X2) U11.15(Y0) U11.16(Y2) U12.2(Y3) U12.3(Y1) U12.9(X3) U12.10(X0) U12.12(X1) U12.13(X2) U12.15(Y0) U12.16(Y2) U13.2(Y3) U13.3(Y1) U13.9(X3) U13.10(X0) U13.12(X1) U13.13(X2) U13.15(Y0) U13.16(Y2) U14.2(Y3) U14.3(Y1) U14.9(X3) U14.10(X0) U14.12(X1) U14.13(X2) U14.15(Y0) U14.16(Y2) U15.2(Y3) U15.3(Y1) U15.9(X3) U15.10(X0) U15.12(X1) U15.13(X2) U15.15(Y0) U15.16(Y2) U16.2(Y3) U16.3(Y1) U16.9(X3) U16.10(X0) U16.12(X1) U16.13(X2) U16.15(Y0) U16.16(Y2) U17.2(Y3) U17.3(Y1) U17.9(X3) U17.10(X0) U17.12(X1) U17.13(X2) U17.15(Y0) U17.16(Y2) U18.2(Y3) U18.3(Y1) U18.9(X3) U18.10(X0) U18.12(X1) U18.13(X2) U18.15(Y0) U18.16(Y2) U19.2(Y3) U19.3(Y1) U19.9(X3) U19.10(X0) U19.12(X1) U19.13(X2) U19.15(Y0) U19.16(Y2) U20.2(Y3) U20.3(Y1) U20.9(X3) U20.10(X0) U20.12(X1) U20.13(X2) U20.15(Y0) U20.16(Y2) U21.2(Y3) U21.3(Y1) U21.9(X3) U21.10(X0) U21.12(X1) U21.13(X2) U21.15(Y0) U21.16(Y2) U22.2(Y3) U22.3(Y1) U22.9(X3) U22.10(X0) U22.12(X1) U22.13(X2) U22.15(Y0) U22.16(Y2) U23.2(Y3) U23.3(Y1) U23.9(X3) U23.10(X0) U23.12(X1) U23.13(X2) U23.15(Y0) U23.16(Y2) U24.2(Y3) U24.3(Y1) U24.9(X3) U24.10(X0) U24.12(X1) U24.13(X2) U24.15(Y0) U24.16(Y2) U25.2(Y3) U25.3(Y1) U25.9(X3) U25.10(X0) U25.12(X1) U25.13(X2) U25.15(Y0) U25.16(Y2) U26.2(Y3) U26.3(Y1) U26.9(X3) U26.10(X0) U26.12(X1) U26.13(X2) U26.15(Y0) U26.16(Y2) U27.2(Y3) U27.3(Y1) U27.9(X3) U27.10(X0) U27.12(X1) U27.13(X2) U27.15(Y0) U27.16(Y2) U28.2(Y3) U28.3(Y1) U28.9(X3) U28.10(X0) U28.12(X1) U28.13(X2) U28.15(Y0) U28.16(Y2) U29.2(Y3) U29.3(Y1) U29.9(X3) U29.10(X0) U29.12(X1) U29.13(X2) U29.15(Y0) U29.16(Y2) U30.2(Y3) U30.3(Y1) U30.9(X3) U30.10(X0) U30.12(X1) U30.13(X2) U30.15(Y0) U30.16(Y2) U31.2(Y3) U31.3(Y1) U31.9(X3) U31.10(X0) U31.12(X1) U31.13(X2) U31.15(Y0) U31.16(Y2) U32.2(Y3) U32.3(Y1) U32.9(X3) U32.10(X0) U32.12(X1) U32.13(X2) U32.15(Y0) U32.16(Y2)

## Library data of the parts
A B C D = jonnew:PINHD-2X35
C1-C16 C19-C34 = jonnew:C: Capacitor
C17 C18 = jonnew:C-POL: Polarized Capacitor
D1 D2 = jonnew:Z-DIODE: Zener Diode; PARTNO: UDZ10B-7
D3 D4 = jonnew:LED: Surface mount LED
J1-J5 = jonnew:JP3E
J6 = jonnew:SCREW4: Screw Terminal
J7 J8 = jonnew:PINHD-4X10
Q1 = jonnew:N-MOSFET: N-CHANNEL MOS FET SYMBOL; PARTNO: DMN3404L-7
Q2 = jonnew:P-MOSFET; PARTNO: DMP3056L-7
R1-R6 = jonnew:R: Resistor; DK: PxxxxHTR-ND; MN: Panasonic; MPN: ERJ-3EKFxxxxV
S1 = jonnew:DIPSW-002: Dip Switch 2 pol.
U1-U32 = jonnew:MUX_2X4:1

## Net classes
1 thick: width 0.102 mm